# EAGLE design Grove-LED Socket Kit v1.0b (EAGLE 6.3)
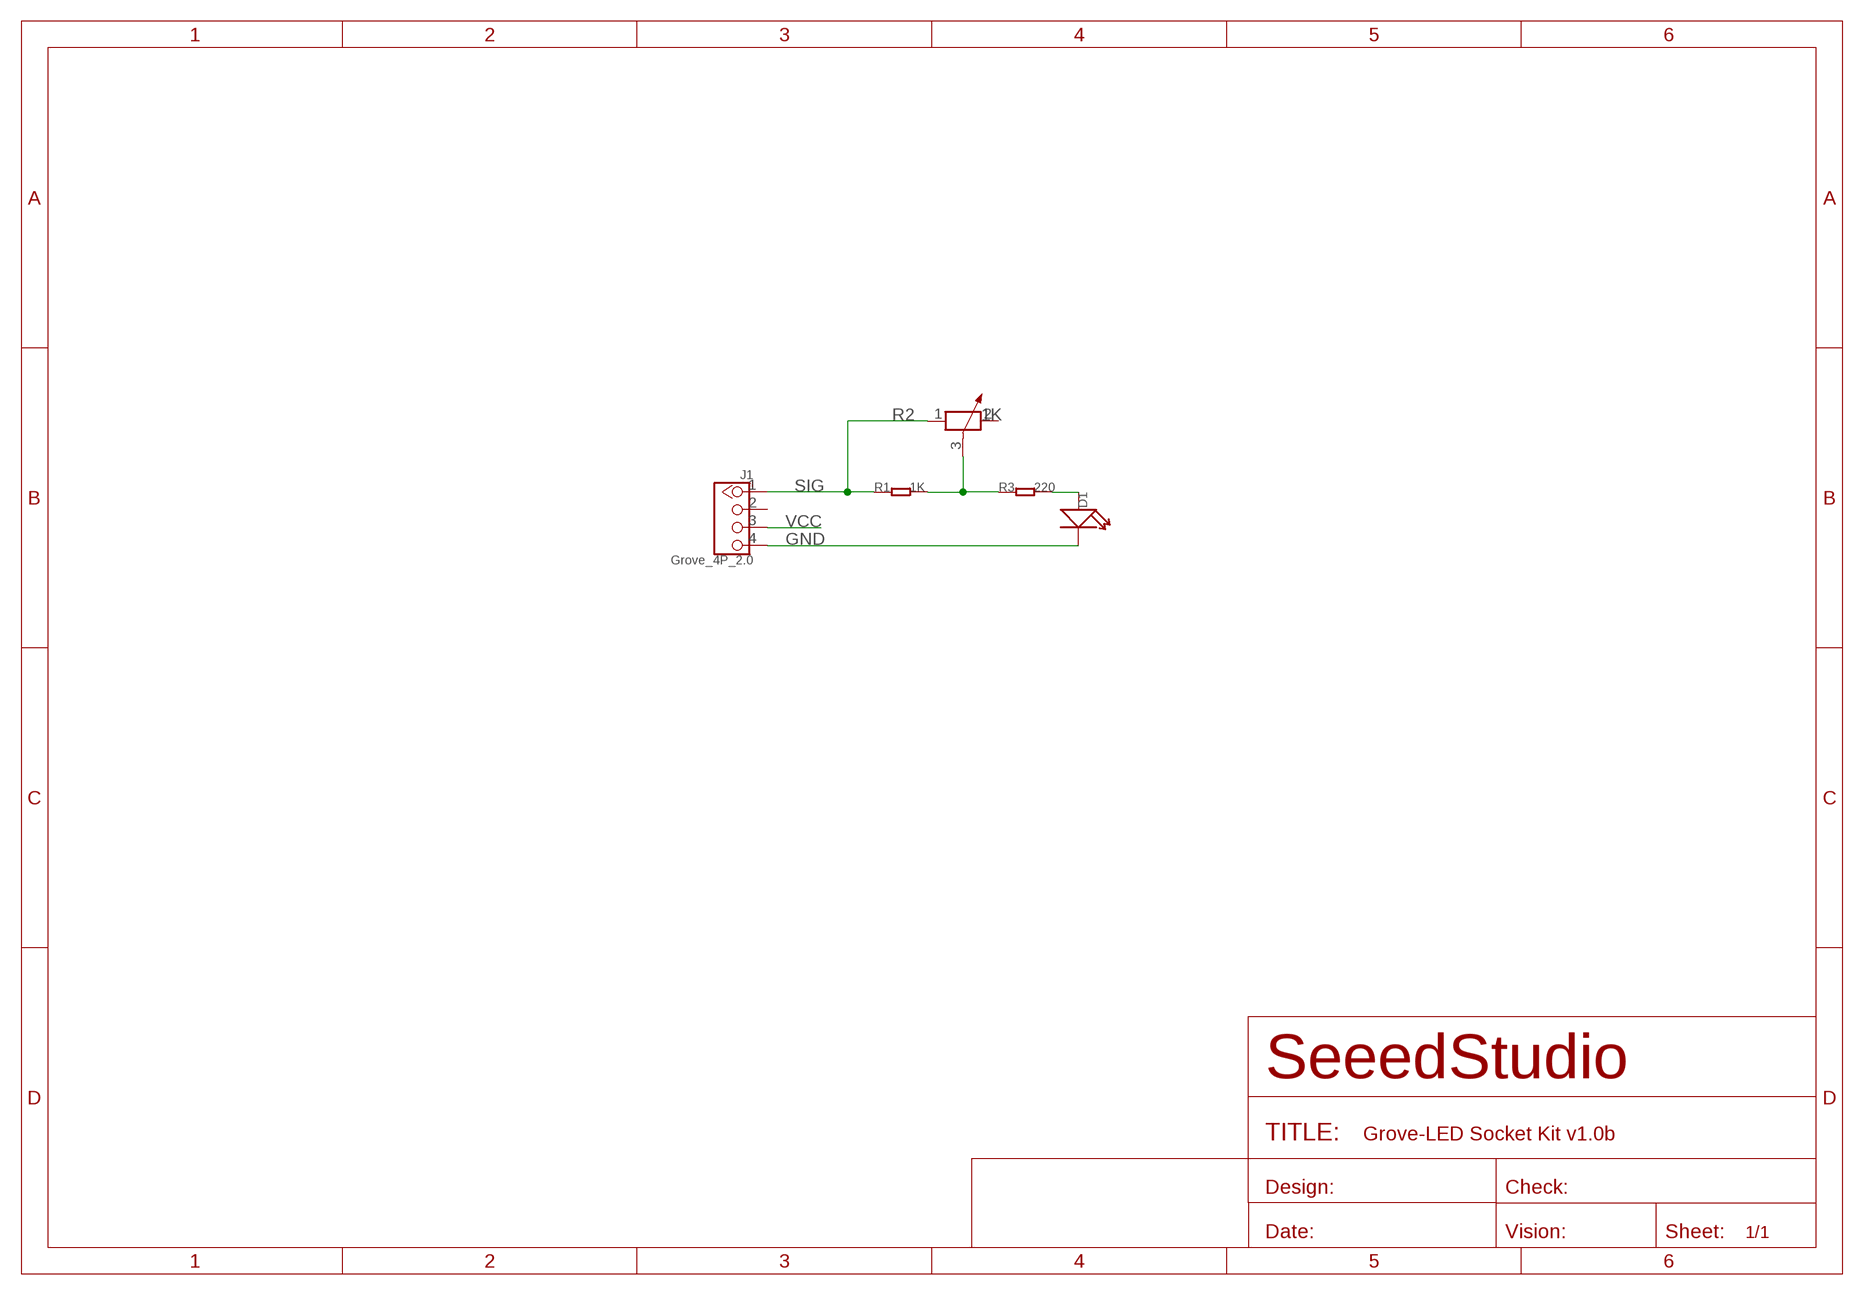
[diagram p0: schematic, sheet 1]

## Parts
D1  LED-6MM  [LED-2P-2.54-6MM]
J1  Grove_4P_2.0  TWIG_2.0  [2.0_1X4]
R1  1K  005-R0603  [0603]
R2  1K  R-POTENTIOMETER'3362'  [3P-SQUA-7X6.8]
R3  220  005-R0603  [0603]

## Nets
GND: D1.- J1.4
N$1: R1.2 R2.3 R3.1
N$3: D1.+ R3.2
SIG: J1.1 R1.1 R2.1
VCC: J1.3
Unconnected: J1.2 R2.2

## Library data of the parts
D1 = Discrete:LED*
J1 = CONNECTER:TWIG_2.0
R1 R3 = Discrete:005-R*
R2 = Discrete:R-POTENTIOMETER*: Potentiometer

## Board
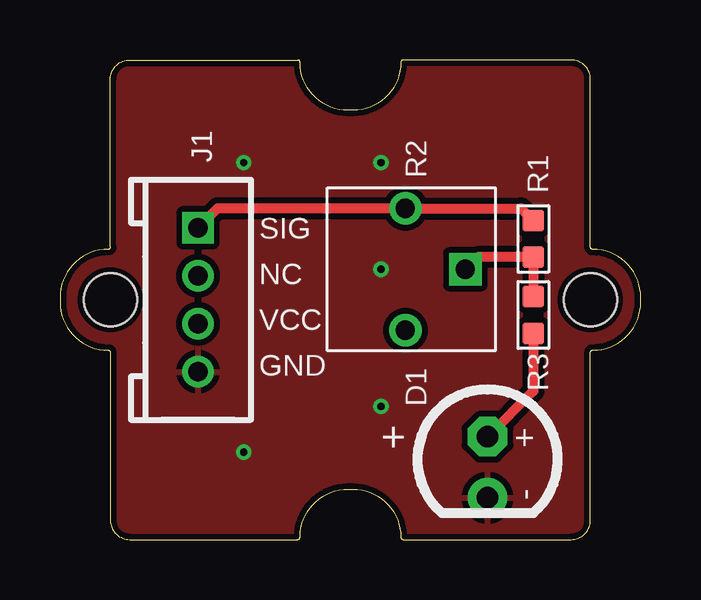
[diagram p1: board, top side]
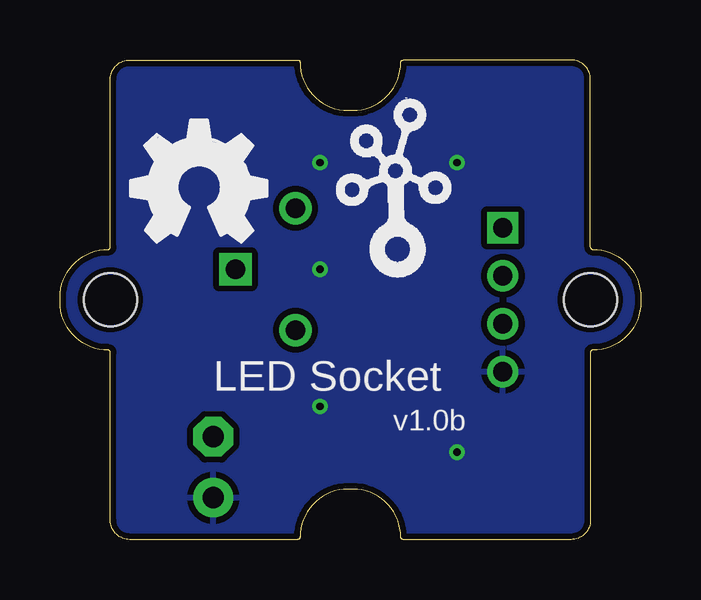
[diagram p2: board, bottom side, seen from below]

Size 24.2 x 20 mm. Coordinates in mm from the lower left corner, seen from the top.
Copper layers (1*16): Top 0.035mm / dielectric 1.5mm / Bottom 0.035mm
Design rules "SeeedStudio_rule_no_angle_090911": minimum track width 6mil, minimum drill 12mil, track to track 6mil, track to pad 6mil, pad to pad 6mil, via to via 6mil, smd to smd 0mil, copper to edge 10mil, drill to drill 10mil, minimum pad ring 10mil, minimum via ring 6mil, stop-mask expansion 2mil, vias tented up to drill 25mil, thermal gap 10mil

### Footprints (pad centres in the part's own frame; a part is rotated, then mirrored left to right if it is on the bottom)
LED-2P-2.54-6MM = drill 0.889 pad 1.651 octagon: + -1.27,0 | drill 0.889 pad 1.651: - 1.27,0
2.0_1X4 = drill 0.8 pad 1.27 square: 1 -3,0 | drill 0.8 pad 1.27: 2 -1,0; 3 1,0; 4 3,0
0603 = smd 0.889 x 0.889: 1 -0.762,0; 2 0.762,0
3P-SQUA-7X6.8 = drill 0.8 pad 1.35: 1 -2.54,-0.25; 2 2.54,-0.25 | drill 0.8 pad 1.35 square: 3 0,2.25
1U-DIM-W/-DRILL = hole 2.2: 0,-10; 0,10

### Placement (x,y rotation side)
D1  17.81,3.01 270 top
J1  5.75,10 270 top
R1  19.72,12.54 270 top
R2  14.64,11.27 270 top
R3  19.72,9.37 270 top
U$2  [1U-DIM-W/-DRILL]  12.1,10 90 top
U$3  [OSHW_FILLX200_NOTEXT]  21.24,12.41 0 bottom
U$4  [TWIGLOGO]  10.2,11.9 0 bottom

### Tracks (layer width: path | path; a pad name or v marks a point on that pad's centre or on a via)
GND  (via drill 0.3 pad 0.64)
  other vias: 13.37,5.55 13.37,11.27 13.37,15.71 7.65,15.71 7.65,3.65
  pour Top (isolate 0.254): -0.6,-0.79 24.8,-0.79 24.8,20.8 -0.6,20.8 -0.6,-0.67
  pour Bottom (isolate 0.254): -0.6,-0.79 24.8,-0.79 24.8,20.8 -0.6,20.8 -0.6,-0.67
N$1
  Top 0.406: R2.3 17.4,11.78 R1.2 R3.1
N$3
  Top 0.406: R3.2 19.72,6.19 D1.+
SIG
  Top 0.406: J1.1 6.56,13.81 R2.1 19.21,13.81 R1.1

### Text on the board
tPlace: SIG | NC | VCC | GND | +
bPlace: LED Socket | v1.0b